# Altium schematic sheet mcuB.SchDoc
size A4; SheetNumber: 1; SheetTotal: 3
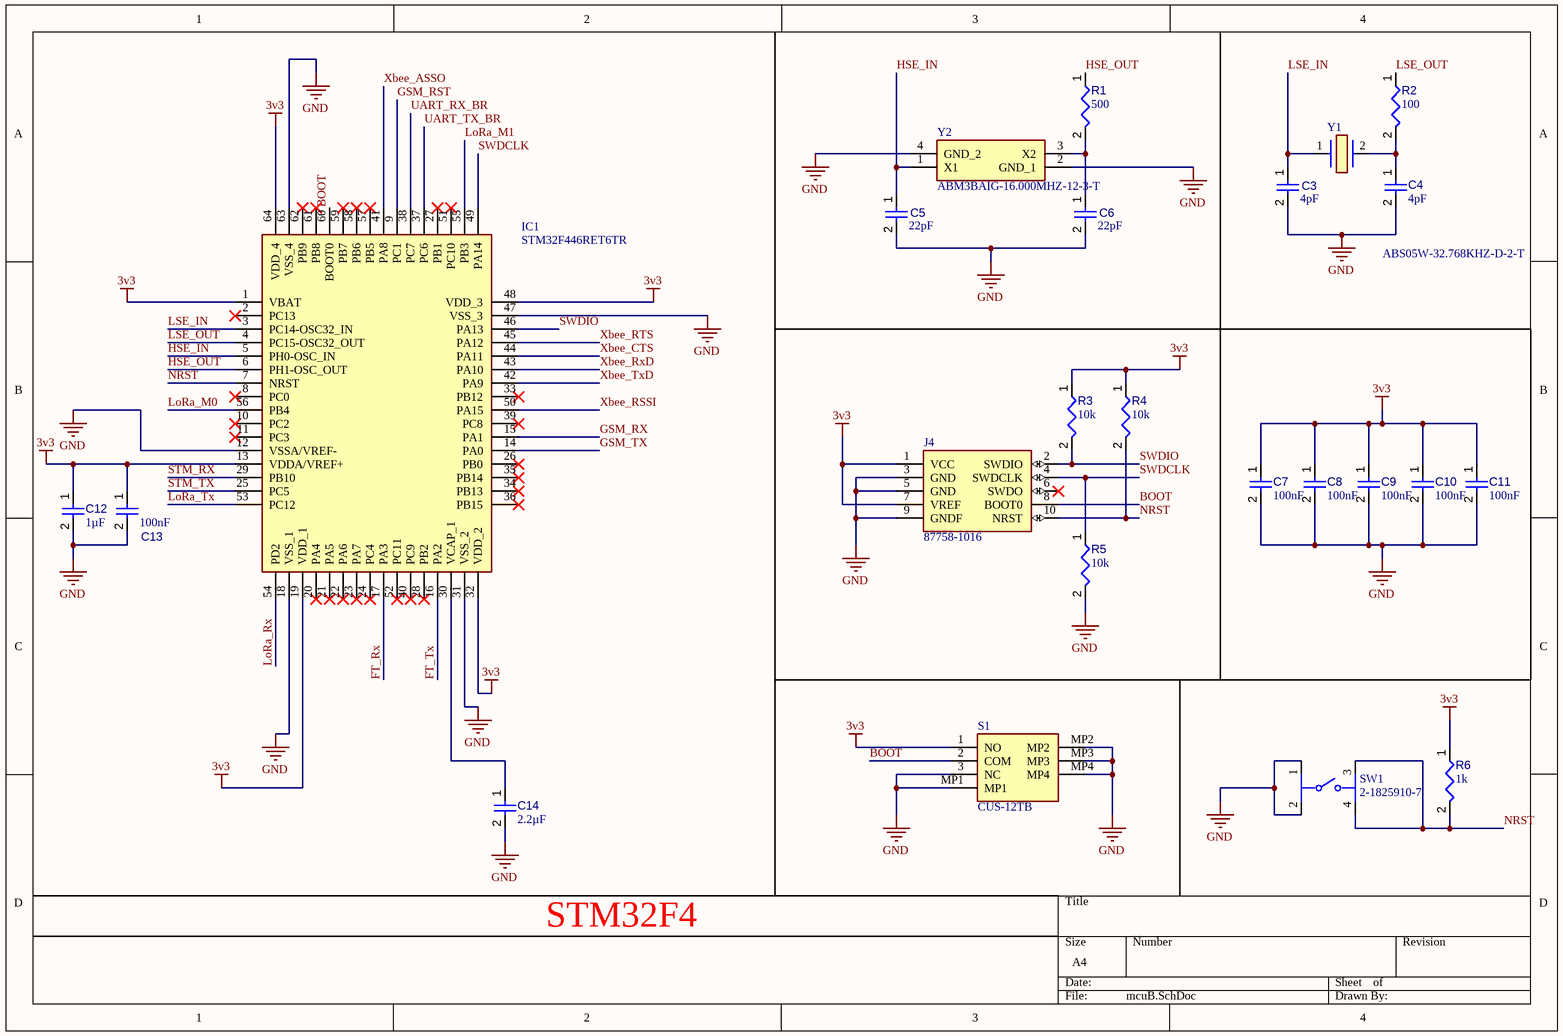
[diagram p0: mcuB.SchDoc]

## Parts
C3  value 4pF  [CAPC1608X90X40LL10T20]  (hidden comment: Capacitor 1 uF +/- 10% 25 V 0603)
C4  value 4pF  [CAPC1608X90X40LL10T20]  (hidden comment: Capacitor 1 uF +/- 10% 25 V 0603)
C5  value 22pF  [CAPC1608X90X40LL10T20]  (hidden comment: Capacitor 1 uF +/- 10% 25 V 0603)
C6  value 22pF  [CAPC1608X90X40LL10T20]  (hidden comment: Capacitor 1 uF +/- 10% 25 V 0603)
C7  value 100nF  [CAPC1608X90X40NL10T20]  (hidden comment: Capacitor 100 nF +/-10% 50 V 0603)
C8  value 100nF  [CAPC1608X90X40NL10T20]  (hidden comment: Capacitor 100 nF +/-10% 50 V 0603)
C9  value 100nF  [CAPC1608X90X40NL10T20]  (hidden comment: Capacitor 100 nF +/-10% 50 V 0603)
C10  value 100nF  [CAPC1608X90X40NL10T20]  (hidden comment: Capacitor 100 nF +/-10% 50 V 0603)
C11  value 100nF  [CAPC1608X90X40NL10T20]  (hidden comment: Capacitor 100 nF +/-10% 50 V 0603)
C12  value 1µF  [CAPC2013X135X45NL10T25]  (hidden comment: Capacitor 1 uF +/- 10% 50 V 0805)
C13  value 100nF  [CAPC1608X90X40NL10T20]  (hidden comment: Capacitor 100 nF +/-10% 50 V 0603)
C14  value 2.2µF  [CAPC2013X135X45NL10T25]  (hidden comment: Capacitor 1 uF +/- 10% 50 V 0805)
IC1  STM32F446RET6TR  [QFP50P1200X1200X160-64N]
J4  87758-1016  [HDRV10W75P200_2X5_990X400X595P]
R1  value 500  [RESC1608X55X25ML10T15]  (hidden comment: Resistor 10k +/-1% 0603 100 mW)
R2  value 100  [RESC1608X55X25ML10T15]  (hidden comment: Resistor 10k +/-1% 0603 100 mW)
R3  value 10k  [RESC1608X55X25ML10T15]  (hidden comment: Resistor 10k +/-1% 0603 100 mW)
R4  value 10k  [RESC1608X55X25ML10T15]  (hidden comment: Resistor 10k +/-1% 0603 100 mW)
R5  value 10k  [RESC1608X55X25ML10T15]  (hidden comment: Resistor 10k +/-1% 0603 100 mW)
R6  value 1k  [RESC1608X55X25ML10T15]  (hidden comment: Resistor 10k +/-1% 0603 100 mW)
S1  CUS-12TB  [CUS12TB]
SW1  2-1825910-7  [FP-2-1825910-7-MFG]
Y1  ABS05W-32.768KHZ-D-2-T  [ABS05W32768KHZD2T]
Y2  ABM3BAIG-16.000MHZ-12-3-T  [ABM3BAIG]

## Nets
3v3: C7.1 C8.1 C9.1 C10.1 C11.1 C12.1 C13.1 IC1.1(VBAT) IC1.13(VDDA/VREF+) IC1.19(VDD_1) IC1.32(VDD_2) IC1.48(VDD_3) IC1.64(VDD_4) J4.1(VCC) J4.7(VREF) R3.1 R4.1 R6.1 S1.1(NO)
GND: C3.2 C4.2 C5.2 C6.2 C7.2 C8.2 C9.2 C10.2 C11.2 C12.2 C13.2 C14.2 IC1.12(VSSA/VREF-) IC1.18(VSS_1) IC1.31(VSS_2) IC1.47(VSS_3) IC1.63(VSS_4) J4.3(GND) J4.5(GND) J4.9(GNDF) R5.2 S1.3(NC) S1.MP1 S1.MP2 S1.MP3 S1.MP4 SW1.1 SW1.2 Y2.2(GND_1) Y2.4(GND_2)
BOOT: IC1.60(BOOT0) J4.8(BOOT0) S1.2(COM)
FT_Rx: IC1.17(PA3)
FT_Tx: IC1.16(PA2)
GSM_RST: IC1.9(PC1)
GSM_RX: IC1.15(PA1)
GSM_TX: IC1.14(PA0)
HSE_IN: C5.1 IC1.5(PH0-OSC_IN) Y2.1(X1)
HSE_OUT: IC1.6(PH1-OSC_OUT) R1.1
LoRa_M0: IC1.56(PB4)
LoRa_M1: IC1.55(PB3)
LoRa_Rx: IC1.54(PD2)
LoRa_Tx: IC1.53(PC12)
LSE_IN: C3.1 IC1.3(PC14-OSC32_IN) Y1.1
LSE_OUT: IC1.4(PC15-OSC32_OUT) R2.1
NRST: IC1.7(NRST) J4.10(NRST) R4.2 R6.2 SW1.3 SW1.4
STM_RX: IC1.29(PB10)
STM_TX: IC1.25(PC5)
SWDCLK: IC1.49(PA14) J4.4(SWDCLK) R5.1
SWDIO: IC1.46(PA13) J4.2(SWDIO) R3.2
UART_RX_BR: IC1.38(PC7)
UART_TX_BR: IC1.37(PC6)
Xbee_ASSO: IC1.41(PA8)
Xbee_CTS: IC1.44(PA11)
Xbee_RSSI: IC1.50(PA15)
Xbee_RTS: IC1.45(PA12)
Xbee_RxD: IC1.43(PA10)
Xbee_TxD: IC1.42(PA9)
NetC4_1: C4.1 R2.2 Y1.2
NetC6_1: C6.1 R1.2 Y2.3(X2)
NetC14_1: C14.1 IC1.30(VCAP_1)

Not connected (* = marked no-connect by the designer): IC1 2(PC13)* 8(PC0)* 10(PC2)* 11(PC3)* 20(PA4)* 21(PA5)* 22(PA6)* 23(PA7)* 24(PC4)* 26(PB0)* 27(PB1)* 28(PB2)* 33(PB12)* 34(PB13)* 35(PB14)* 36(PB15)* 39(PC8)* 40(PC9)* 51(PC10)* 52(PC11)* 57(PB5)* 58(PB6)* 59(PB7)* 61(PB8)* 62(PB9)*; J4 6(SWDO)*

## Notes on the sheet
- STM32F4

## Library data of the parts
C3-C6 = CMP-001-00005-6: Chip Capacitor, 1 uF, +/- 10%, 25 V, 0603 (1608 Metric); Capacitor Type: Ceramic; Voltage Rating: 25V; Pins: 2; Mounting Technology: SM; RoHS Compliant: True; Max Operating Temperature: 125°C; Case/Package: 0603; Min Operating Temperature: -55°C; Tolerance: 10%
C7-C11 C13 = CMP-001-00017-6: Chip Capacitor, 100 nF, +/- 10%, 50 V, 0603 (1608 Metric); Voltage Rating: 50V; Capacitor Type: Ceramic; Tolerance: 10%; Mounting Technology: SM; Max Operating Temperature: 125°C; RoHS Compliant: True; Pins: 2; Case/Package: 0603; Min Operating Temperature: -55°C
C12 C14 = CMP-001-00007-6: Chip Capacitor, 1 uF, +/- 10%, 50 V, 0805 (2012 Metric); Capacitor Type: Ceramic; Voltage Rating: 50V; Min Operating Temperature: -55°C; RoHS Compliant: True; Mounting Technology: SM; Case/Package: 0805; Max Operating Temperature: 125°C; Tolerance: 10%; Pins: 2
IC1 = STM32F446RET6TR: Integrated Circuit; Manufacturer_Name: STMicroelectronics; Datasheet Link: https://www.arrow.com/en/products/stm32f446ret6tr/stmicroelectronics; Height: 1.6mm; Manufacturer_Part_Number: STM32F446RET6TR; Mouser Part Number: 511-STM32F446RET6TR; Mouser Price/Stock: https://www.mouser.co.uk/ProductDetail/STMicroelectronics/STM32F446RET6TR?qs=xZ%2FP%252Ba9zWqYaBJrnMqQZtg%3D%3D; Arrow Part Number: STM32F446RET6TR; Arrow Price/Stock: https://www.arrow.com/en/products/stm32f446ret6tr/stmicroelectronics?utm_currency=USD&region=nac
J4 = 87758-1016: Connector; Manufacturer_Name: Molex; Datasheet Link: http://www.molex.com/pdm_docs/sd/877581016_sd.pdf; Height: 5.95mm; Manufacturer_Part_Number: 87758-1016; Mouser Part Number: 538-87758-1016; Mouser Price/Stock: https://www.mouser.co.uk/ProductDetail/Molex/87758-1016?qs=9Wl4wMk6NjrOw5AcqxMewg%3D%3D; Arrow Part Number: 87758-1016; Arrow Price/Stock: https://www.arrow.com/en/products/87758-1016/molex?region=nac
R1-R6 = CMP-009-00017-5: Chip Resistor, 10 KOhm, +/- 1%, 01 W, -55 to 155 degC, 0603 (1608 Metric); Voltage Rating: 50V; Power: 100mW; RoHS Compliant: True; Min Operating Temperature: -55°C; Pins: 2; Case/Package: 0603; Mounting Technology: SM; Max Operating Temperature: 155°C; Tolerance: 1%
S1 = CUS-12TB: Switch; Manufacturer_Name: Nidec Copal; Datasheet Link: https://www.nidec-copal-electronics.com/e/catalog/switch/cus.pdf; Height: 1.4mm; Manufacturer_Part_Number: CUS-12TB; Mouser Part Number: 229-CUS-12TB; Mouser Price/Stock: https://www.mouser.co.uk/ProductDetail/Nidec-Components/CUS-12TB?qs=XeJtXLiO41Q1Ug1dC3Bq%2FQ%3D%3D
SW1 = CMP-03402-000004-1: SWITCH TACTILE SPST-NO 0.05A 24V; Manufacturer: TE Connectivity; Contact Current Rating: 50mA; Operating Force: 160gf; Electromechanical Life: 100000Cycles; Contact Resistance: 100mΩ; ComponentLink2Description: Datasheet; Height: 13.3mm; Digikey Description: SWITCH TACTILE SPST-NO 0.05A 24V; Device Class L2: Switches; Category: Switch; Device Class L3: Pushbutton Switches; Manufacturer Part Number: 2-1825910-7; Device Class L1: Electromechanical; Mount: Through Hole; Temperature Range High: +85°C; ComponentLink2URL: https://www.te.com/commerce/DocumentDelivery/DDEController?Action=showdoc&DocId=Customer+Drawing%7F1825910%7FC10%7Fpdf%7FEnglish%7FENG_CD_1825910_C10.pdf%7F2-1825910-7; RoHS: TRUE; Temperature: -35°C to +85°C; Mouser Description: Switch Tactile OFF (ON) SPST Extended Round Button PC Pins 0.05A 24VDC 100000Cycles 1.57N Thru-Hole Loose; Automotive: No; Voltage Rating Dc: 24V; Package: 2-1825910-7; Lead Free: Yes; Octopart: https://octopart.com/2-1825910-7-te+connectivity-42270510; Temperature Range Low: -35°C; Throw Configuration: SPST-NO
Y1 = ABS05W-32.768KHZ-D-2-T: Crystal or Oscillator; Manufacturer_Name: ABRACON; Datasheet Link: https://abracon.com/Resonators/ABS05W.pdf; Height: 0.5mm; Manufacturer_Part_Number: ABS05W-32.768KHZ-D-2-T; Mouser Part Number: 815-ABS05W32.768KD2T; Mouser Price/Stock: https://www.mouser.co.uk/ProductDetail/ABRACON/ABS05W-32.768KHZ-D-2-T?qs=r5DSvlrkXmJ0aADBg3hvfA%3D%3D; Arrow Part Number: ABS05W-32.768KHZ-D-2-T; Arrow Price/Stock: https://www.arrow.com/en/products/abs05w-32.768khz-d-2-t/abracon?utm_currency=USD&region=nac
Y2 = ABM3BAIG-16.000MHZ-12-3-T: Crystal or Oscillator; Manufacturer_Name: ABRACON; Datasheet Link: https://abracon.com/AIGcrystals/ABM3BAIG.pdf; Height: 0.9mm; Manufacturer_Part_Number: ABM3BAIG-16.000MHZ-12-3-T